# Altium schematic sheet mcu.SchDoc
size A4; SheetNumber: 4; SheetTotal: 4
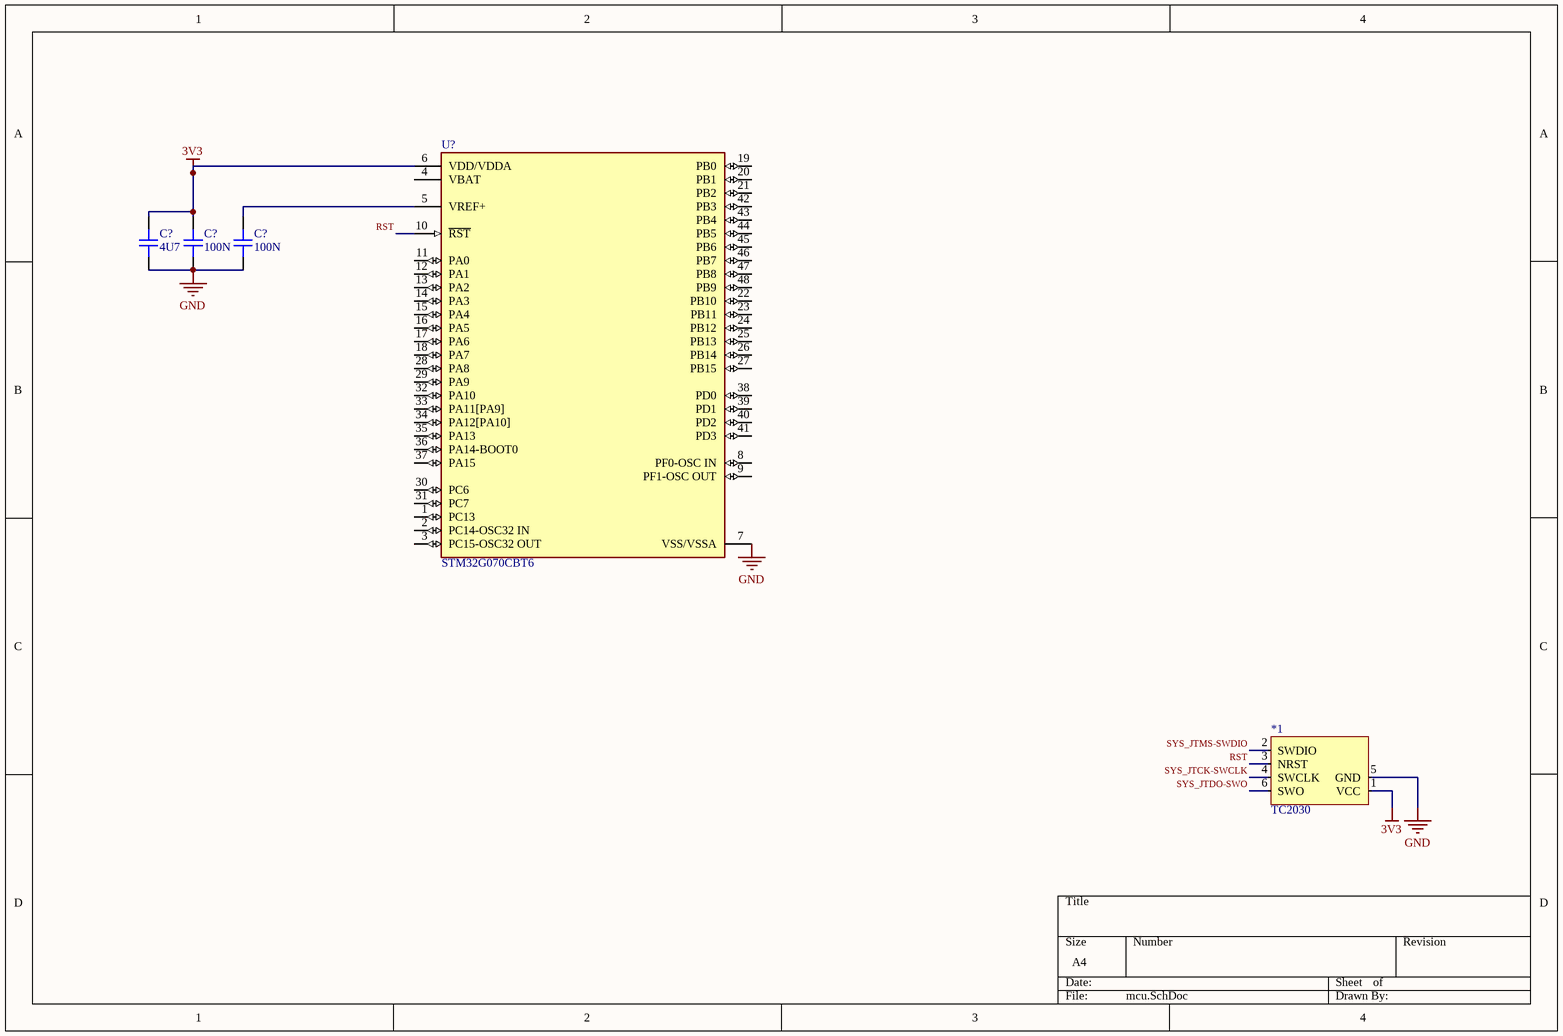
[diagram p0: mcu.SchDoc]

## Parts
(Parts that share a designator on the sheet are numbered #1, #2 ... from top to bottom, then left to right.)
*1  TC2030  [TC2030-IDC-NL]
C?#1  4U7  [CAP_0805]
C?#2  100N  [CAP_0603]
C?#3  100N  [CAP_0603]
U?  STM32G070CBT6  [FP-LQFP48-5B-MFG]

## Nets
3V3: *1.1(VCC) C?#1.2 C?#2.2 U?.6(VDD/VDDA)
GND: *1.5(GND) C?#1.1 C?#2.1 C?#3.1 U?.7(VSS/VSSA)
RST: *1.3(NRST) U?.10(~{RST})
SYS_JTCK-SWCLK: *1.4(SWCLK)
SYS_JTDO-SWO: *1.6(SWO)
SYS_JTMS-SWDIO: *1.2(SWDIO)
NetC?#3_2: C?#3.2 U?.5(VREF+)

Not connected (* = marked no-connect by the designer): U? 1(PC13) 2(PC14-OSC32_IN) 3(PC15-OSC32_OUT) 4(VBAT) 8(PF0-OSC_IN) 9(PF1-OSC_OUT) 11(PA0) 12(PA1) 13(PA2) 14(PA3) 15(PA4) 16(PA5) 17(PA6) 18(PA7) 19(PB0) 20(PB1) 21(PB2) 22(PB10) 23(PB11) 24(PB12) 25(PB13) 26(PB14) 27(PB15) 28(PA8) 29(PA9) 30(PC6) 31(PC7) 32(PA10) 33(PA11[PA9]) 34(PA12[PA10]) 35(PA13) 36(PA14-BOOT0) 37(PA15) 38(PD0) 39(PD1) 40(PD2) 41(PD3) 42(PB3) 43(PB4) 44(PB5) 45(PB6) 46(PB7) 47(PB8) 48(PB9)

## Library data of the parts
*1 = CMP-002-00072-1: Adapter Cable For Cortex
C?#1 = CAP_0805_16V: Capacitor SMD 0805 16V
C?#2 C?#3 = CAP_0603_16V: Capacitor SMD 0603 16V
U? = CMP-12105-000112-1: IC MCU 32BIT 128KB FLASH 48LQFP; RoHS Compliant: Yes